# Altium schematic sheet Power.SchDoc
size A4; DocumentNumber: 3; SheetNumber: 3; SheetTotal: 8
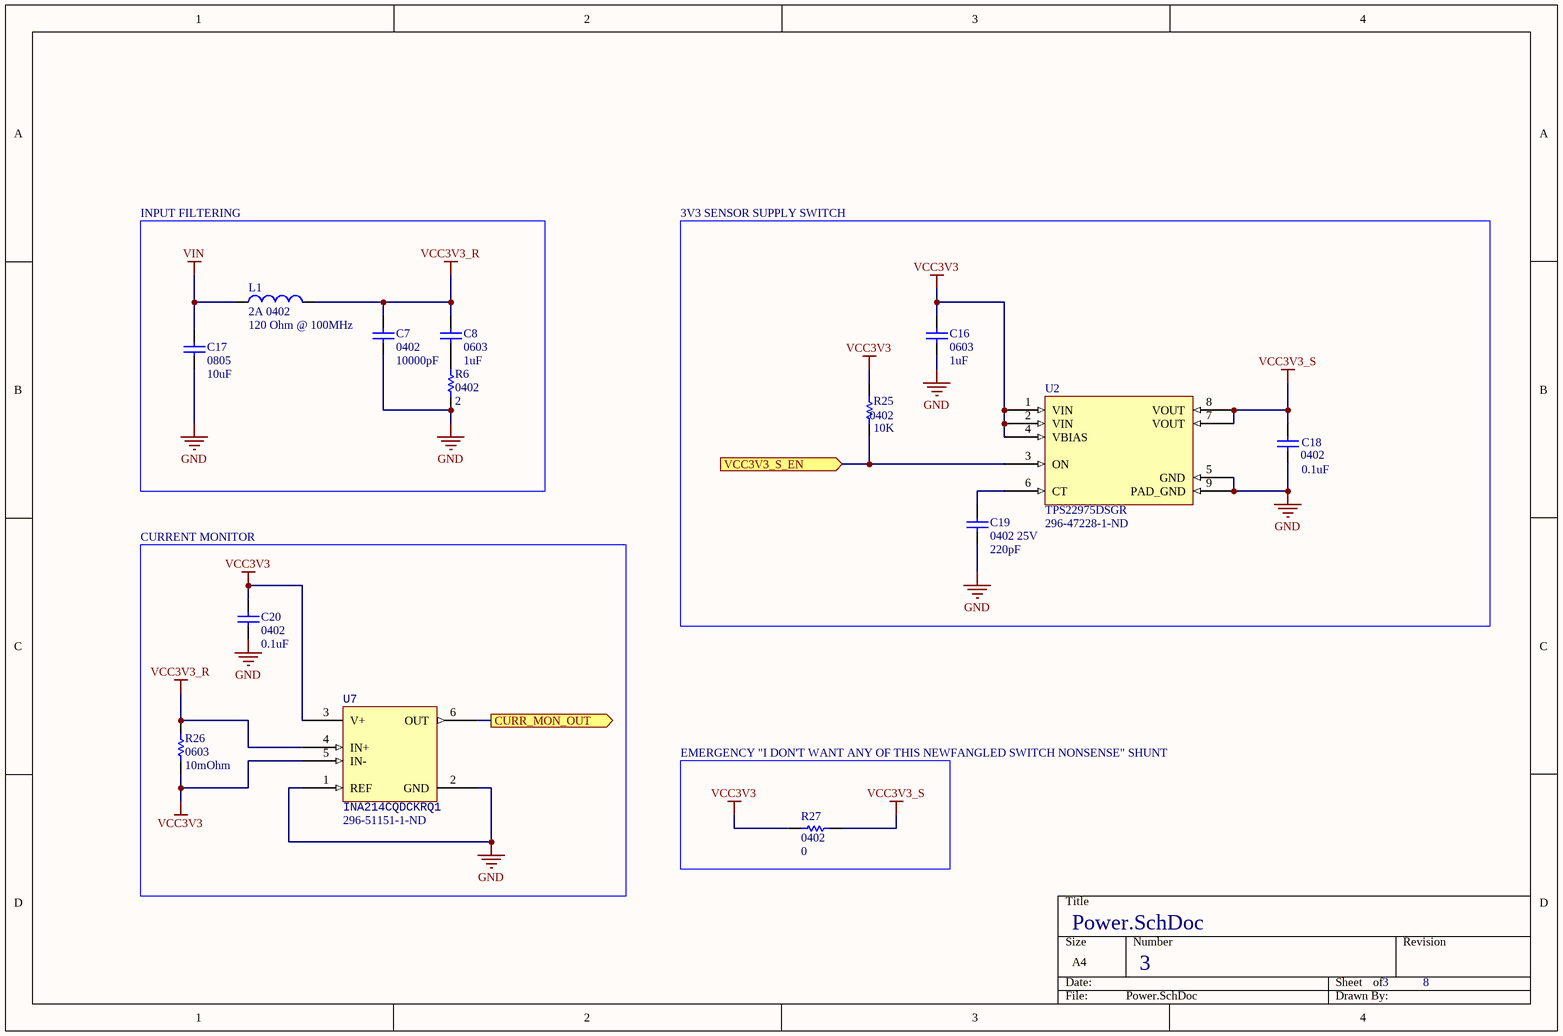
[diagram p0: Power.SchDoc]

## Parts
C7  0402  value 10000pF  [CAP0402R]
C8  0603  value 1uF  [CAP0603R]
C16  0603  value 1uF  [CAP0603R]
C17  0805  value 10uF  [CAP0805R]
C18  0402  value 0.1uF  [CAP0402R]
C19  0402 25V  value 220pF  [CAP0402R]
C20  0402  value 0.1uF  [CAP0402R]
L1  2A 0402  value 120 Ohm @ 100MHz  [RES0402R]
R6  0402  value 2  [RES0402R]
R25  0402  value 10K  [RES0402R]
R26  0603  value 10mOhm  [RES0603R]
R27  0402  value 0  [RES0402R]
U2  TPS22975DSGR  Supplier Part Number 1: 296-47228-1-ND  [DSG0008A]
U7  INA214CQDCKRQ1  Supplier Part Number 1: 296-51151-1-ND  [TI-SOT-SC70 (DCK)]

## Blocks framed on the sheet
INPUT FILTERING: C7 C8 C17 L1 R6
3V3 SENSOR SUPPLY SWITCH: C16 C18 C19 R25 U2
CURRENT MONITOR: C20 R26 U7

## Ports
CURR_MON_OUT (out), VCC3V3_S_EN (in)

## Nets
GND: C7.1 C16.1 C17.1 C18.1 C19.1 C20.2 R6.1 U2.5(GND) U2.9(PAD_GND) U7.1(REF) U7.2(GND)
VCC3V3: C16.2 C20.1 R25.2 R26.2 R27.2 U2.1(VIN) U2.2(VIN) U2.4(VBIAS) U7.3(V+) U7.5(IN-)
VCC3V3_R: C7.2 C8.2 L1.2 R26.1 U7.4(IN+)
VCC3V3_S: C18.2 R27.1 U2.7(VOUT) U2.8(VOUT)
VIN: C17.2 L1.1
CURR_MON_OUT: U7.6(OUT) ; port CURR_MON_OUT
VCC3V3_S_EN: R25.1 U2.3(ON) ; port VCC3V3_S_EN
NetC8_1: C8.1 R6.2
NetC19_2: C19.2 U2.6(CT)

## Notes on the sheet
- EMERGENCY "I DON'T WANT ANY OF THIS NEWFANGLED SWITCH NONSENSE" SHUNT

## Library data of the parts
C7 C8 C16 C17 C20 = Cap: Capacitor; Published: 8-Jun-2000; LatestRevisionDate: 17-Jul-2002; LatestRevisionNote: Re-released for DXP Platform.; PackageReference: RAD-0.3; Publisher: Altium Limited; PackageDescription: Radial Cap, Thru-Hole; 2 Leads; 0.3 in Pin Spacing
C18 = Cap Semi: Capacitor (Semiconductor SIM Model); Manufacturer: Murata; Manufacturer Part Number: GCM155R71C104KA55J; Capacitance: 100nF; Tolerance: 10%; Voltage Rating: 16V; Dielectric: X7R; Published: 8-Jun-2000; LatestRevisionDate: 29-May-2009; LatestRevisionNote: IPC-7351 Footprint Added.; PackageReference: C1206; Publisher: Altium Limited; PackageDescription: Chip Capacitor; Supplier 1: Digi-Key; Supplier Part Number 1: 587-3807-1-ND; Supplier 2: Digi-Key; Supplier Part Number 2: 490-7998-1-ND; Stock 2: 5962647; Pricing 2: 1=0.1, 10=0.058, 100=0.026, 500=0.01858, 1000=0.0146, 2500=0.01328, 5000=0.01221 (USD); Mount: Surface Mount; Case/Package: 0402; Case Code (Imperial): 0402; Case Code (Metric): 1005; Min Operating Temperature: -55°C; Max Operating Temperature: 125°C; Voltage Rating (DC): 16V; Packaging: Tape and Reel; Package Quantity: 1; Termination: SMD/SMT; Length: 1mm; Height: 0.5mm; Width: 0.5mm; Thickness: 0.022inch; Depth: 0.5mm; Ratings: AEC-Q200; Radiation Hardening: No; Lead Free: Lead Free; ComponentLink1URL: http://psearch.murata.com/capacitor/product/GCM155R71C104KA55%23.pdf?src-supplier=Avnet; ComponentLink1Description: http://psearch.murata.com/capacitor/product/GCM155R71C104KA55%23.pdf?src-supplier=Avnet; ComponentLink2URL: http://www1.futureelectronics.com/doc/MURATA/GCM155R71C104KA55J.pdf?src-supplier=Future+Electronics; ComponentLink2Description: http://www1.futureelectronics.com/doc/MURATA/GCM155R71C104KA55J.pdf?src-supplier=Future+Electronics; ComponentLink3URL: http://psearch.en.murata.com/capacitor/product/GCM155R71C104KA55%23.pdf?src-supplier=Digi-Key; ComponentLink3Description: http://psearch.en.murata.com/capacitor/product/GCM155R71C104KA55%23.pdf?src-supplier=Digi-Key; ComponentLink4URL: http://search.murata.co.jp/Ceramy/image/img/A01X/partnumbering_e_02.pdf?src-supplier=Digi-Key; ComponentLink4Description: http://search.murata.co.jp/Ceramy/image/img/A01X/partnumbering_e_02.pdf?src-supplier=Digi-Key
C19 = Cap: Capacitor; Manufacturer: Murata; Manufacturer Part Number: GCM155R71H221KA37D; Tolerance: 10%; Voltage Rating: 50V; Dielectric: X7R; Published: 8-Jun-2000; LatestRevisionDate: 17-Jul-2002; LatestRevisionNote: Re-released for DXP Platform.; PackageReference: RAD-0.3; Publisher: Altium Limited; PackageDescription: Radial Cap, Thru-Hole; 2 Leads; 0.3 in Pin Spacing; Supplier 1: Digi-Key; Supplier Part Number 1: 490-4912-1-ND; Stock 1: 43838; Pricing 1: 1=0.1, 10=0.059, 100=0.0264, 500=0.01884, 1000=0.0148, 2500=0.01346, 5000=0.01238 (USD); Mount: Surface Mount; Case/Package: 0402; Case Code (Imperial): 0402; Case Code (Metric): 1005; Min Operating Temperature: -55°C; Max Operating Temperature: 125°C; Capacitance: 220pF; Package Quantity: 1; Packaging: Tape and Reel; Termination: SMD/SMT; Voltage: 50V; Voltage Rating (DC): 50V; Length: 1mm; Height: 0.5mm; Width: 0.02inch; Thickness: 0.022inch; Depth: 0.5mm; Ratings: AEC-Q200; Radiation Hardening: No; ComponentLink1URL: http://psearch.murata.com/capacitor/product/GCM155R71H221KA37%23.pdf?src-supplier=Avnet+Europe; ComponentLink1Description: http://psearch.murata.com/capacitor/product/GCM155R71H221KA37%23.pdf?src-supplier=Avnet+Europe; ComponentLink2URL: http://search.murata.co.jp/Ceramy/image/img/A01X/partnumbering_e_02.pdf?src-supplier=Digi-Key; ComponentLink2Description: http://search.murata.co.jp/Ceramy/image/img/A01X/partnumbering_e_02.pdf?src-supplier=Digi-Key; ComponentLink3URL: https://www.murata.com/~/media/webrenewal/support/library/catalog/products/capacitor/mlcc/c03e.ashx?src-supplier=Avnet; ComponentLink3Description: https://www.murata.com/~/media/webrenewal/support/library/catalog/products/capacitor/mlcc/c03e.ashx?src-supplier=Avnet
L1 = Inductor: Manufacturer: Murata; Manufacturer Part Number: BLM15PX121SZ1D; Code_IEC: 1005; Number of Lines: 1; DC Resistance (DCR): 55mR; Published: 8-Jun-2000; LatestRevisionDate: 29-May-2009; LatestRevisionNote: IPC-7351 Footprint Added.; PackageReference: 0402-A; Publisher: Altium Limited; PackageDescription: Chip Inductor; Code_JEITA: 0402; Supplier 1: Digi-Key; Supplier Part Number 1: 490-16505-1-ND; Stock 1: 18936; Pricing 1: 1=0.15, 10=0.125, 25=0.0972, 50=0.0804, 100=0.0693, 250=0.05544, 500=0.0499, 1000=0.04158, 5000=0.03881 (USD); Mount: Surface Mount; Case/Package: 0402; Case Code (Imperial): 0402; Case Code (Metric): 1005; Min Operating Temperature: -55°C; Max Operating Temperature: 125°C; Packaging: Cut Tape; Max Current Rating: 2A; Ratings: AEC-Q200
R6 R25 R26 = Res1: Resistor; Published: 8-Jun-2000; LatestRevisionDate: 17-Jul-2002; LatestRevisionNote: Re-released for DXP Platform.; PackageReference: AXIAL-0.3; Publisher: Altium Limited; PackageDescription: Axial Device, Thru-Hole; 2 Leads; 0.3 in Pin Spacing
  R25: Supplier 1: Digi-Key
R27 = Res1: Resistor; Manufacturer: Panasonic; Manufacturer Part Number: ERJ2GE0R00X; Resistance: 0mR; Power Rating: 100mW; Voltage Rating: 50V; Tolerance: 5%; Temperature Coefficient: 600ppm/°C; Published: 8-Jun-2000; LatestRevisionDate: 17-Jul-2002; LatestRevisionNote: Re-released for DXP Platform.; PackageReference: AXIAL-0.3; Publisher: Altium Limited; PackageDescription: Axial Device, Thru-Hole; 2 Leads; 0.3 in Pin Spacing; Supplier 1: Digi-Key; Supplier 2: Digi-Key; Supplier Part Number 2: P0.0JCT-ND; Stock 2: 51531353; Pricing 2: 1=0.1, 10=0.03, 25=0.0216, 50=0.0164, 100=0.0121, 250=0.00924, 500=0.0074, 1000=0.00545, 5000=0.00391 (USD); Mount: Surface Mount; Case/Package: 0402; Case Code (Metric): 1005; Case Code (Imperial): 0402; Contact Plating: Tin; Min Operating Temperature: -55°C; Max Operating Temperature: 155°C; Packaging: Tape and Reel; Package Quantity: 1; Composition: Thick Film; Number of Terminations: 2; Termination: SMD/SMT; Military Standard: Not; Max Power Dissipation: 100mW; Voltage Rating (DC): 50V; Features: Automotive AEC-Q200; Length: 1mm; Height: 0.35mm; Width: 0.02inch; Depth: 0.5mm; Radiation Hardening: No; REACH SVHC: No SVHC; Lead Free: Lead Free; ComponentLink1URL: http://industrial.panasonic.com/www-data/pdf/AOA0000/AOA0000CE1.pdf?src-supplier=Avnet; ComponentLink1Description: http://industrial.panasonic.com/www-data/pdf/AOA0000/AOA0000CE1.pdf?src-supplier=Avnet; ComponentLink2URL: http://www.alliedelec.com/m/d/51cd0790071e1666bdb9d00c57fcf960.pdf?src-supplier=Allied+Electronics; ComponentLink2Description: http://www.alliedelec.com/m/d/51cd0790071e1666bdb9d00c57fcf960.pdf?src-supplier=Allied+Electronics; ComponentLink3URL: http://industrial.panasonic.com/www-data/pdf/AOA0000/AOA0000CE1.pdf?src-supplier=Avnet+Europe; ComponentLink3Description: http://industrial.panasonic.com/www-data/pdf/AOA0000/AOA0000CE1.pdf?src-supplier=Avnet+Europe; ComponentLink4URL: http://www.farnell.com/datasheets/2059623.pdf?src-supplier=Farnell; ComponentLink4Description: http://www.farnell.com/datasheets/2059623.pdf?src-supplier=Farnell; ComponentLink5URL: http://www.farnell.com/datasheets/1678796.pdf?src-supplier=Element14; ComponentLink5Description: http://www.farnell.com/datasheets/1678796.pdf?src-supplier=Element14; ComponentLink6URL: http://www.farnell.com/datasheets/2059623.pdf?src-supplier=Element14; ComponentLink6Description: http://www.farnell.com/datasheets/2059623.pdf?src-supplier=Element14
U2 = TPS22975DSGR: IC LOAD SWITCH N-CH 6A 8WSON; Supplier 1: Digi-Key; ComponentLink1Description: Datasheet; ComponentLink1URL: http://www.ti.com/general/docs/suppproductinfo.tsp?distId=10&gotoUrl=http%3A%2F%2Fwww.ti.com%2Flit%2Fgpn%2Ftps22975
U7 = INA214CQDCKRQ1: IC CURR SENSE 1 CIRCUIT SC70-6; Supplier 1: Digi-Key; ComponentLink1Description: Datasheet; ComponentLink1URL: http://www.ti.com/general/docs/suppproductinfo.tsp?distId=10&gotoUrl=http%3A%2F%2Fwww.ti.com%2Flit%2Fgpn%2Fina213-q1